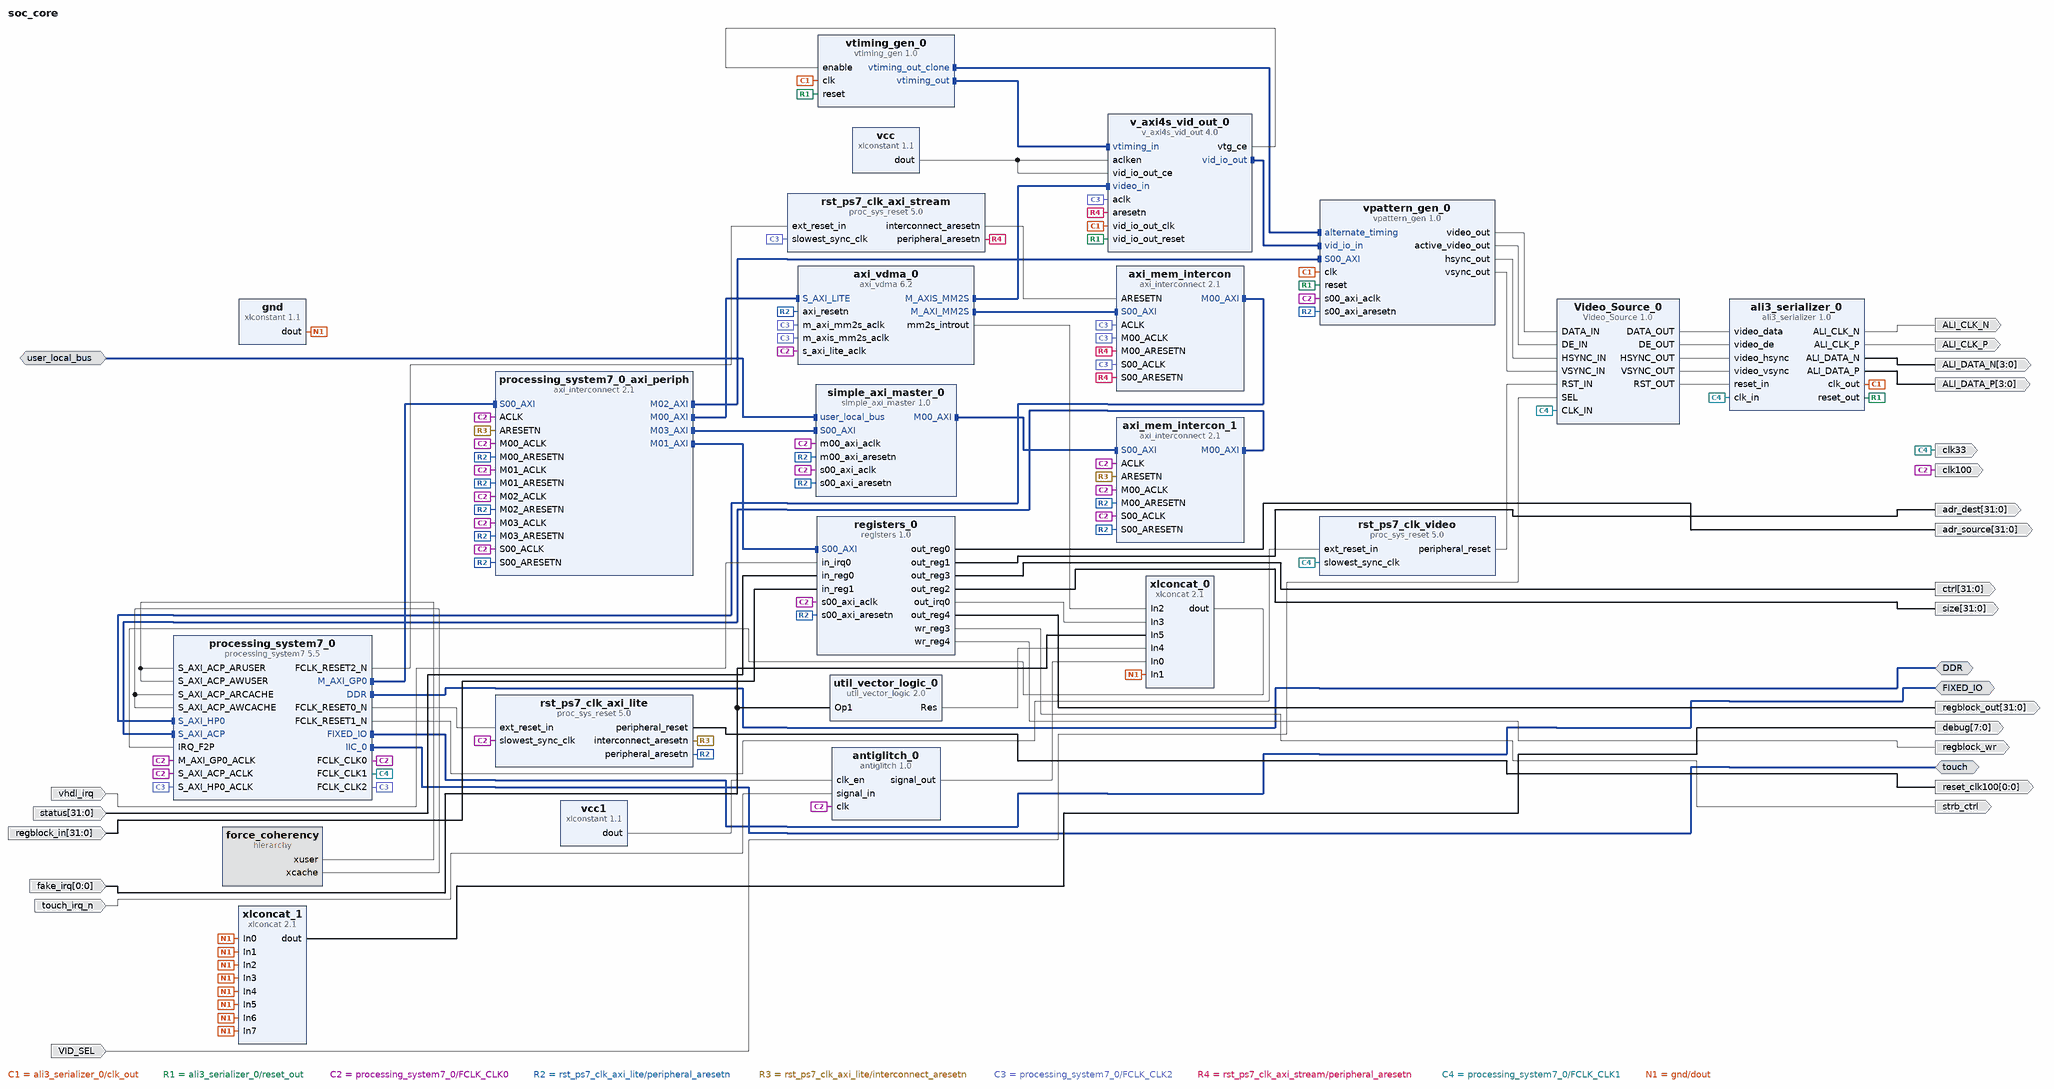
[diagram p0: block diagram of the top level]
# Vivado block design soc_core, Vivado 2015.4
create_bd_design soc_core

create_bd_intf_port -mode Master -vlnv xilinx.com:interface:ddrx_rtl:1.0 DDR
create_bd_intf_port -mode Master -vlnv xilinx.com:display_processing_system7:fixedio_rtl:1.0 FIXED_IO
create_bd_intf_port -mode Slave -vlnv ALE:user:local_bus_rtl:1.0 user_local_bus
create_bd_intf_port -mode Master -vlnv xilinx.com:interface:iic_rtl:1.0 touch
create_bd_port -dir O clk100
create_bd_port -dir O clk33
create_bd_port -dir I touch_irq_n
create_bd_port -dir O ALI_CLK_N
create_bd_port -dir O ALI_CLK_P
create_bd_port -dir O -from 3 -to 0 ALI_DATA_N
create_bd_port -dir O -from 3 -to 0 ALI_DATA_P
create_bd_port -dir O -from 7 -to 0 debug
create_bd_port -dir I vhdl_irq
create_bd_port -dir O -from 31 -to 0 adr_source
create_bd_port -dir O -from 31 -to 0 adr_dest
create_bd_port -dir O -from 31 -to 0 size
create_bd_port -dir O -from 31 -to 0 ctrl
create_bd_port -dir I -from 31 -to 0 status
create_bd_port -dir O -from 0 -to 0 -type rst reset_clk100
create_bd_port -dir O strb_ctrl
create_bd_port -dir I -from 0 -to 0 fake_irq
create_bd_port -dir O -from 31 -to 0 regblock_out
create_bd_port -dir O regblock_wr
create_bd_port -dir I -from 31 -to 0 regblock_in
create_bd_port -dir I VID_SEL

create_bd_cell -type ip -vlnv xilinx.com:ip:v_axi4s_vid_out:4.0 v_axi4s_vid_out_0
set_property -dict [list \
  CONFIG.C_S_AXIS_VIDEO_FORMAT 6 \
  CONFIG.C_HAS_ASYNC_CLK 1 \
  CONFIG.C_VTG_MASTER_SLAVE 1 \
] [get_bd_cells v_axi4s_vid_out_0]
create_bd_cell -type ip -vlnv adetel.com:user:ali3_serializer:1.0 ali3_serializer_0
create_bd_cell -type ip -vlnv xilinx.com:ip:xlconcat:2.1 xlconcat_0
set_property -dict {CONFIG.NUM_PORTS 6} [get_bd_cells xlconcat_0]
create_bd_cell -type ip -vlnv xilinx.com:ip:axi_vdma:6.2 axi_vdma_0
set_property -dict [list \
  CONFIG.c_num_fstores 1 \
  CONFIG.c_mm2s_genlock_mode 0 \
  CONFIG.c_mm2s_linebuffer_depth 4096 \
  CONFIG.c_mm2s_max_burst_length 16 \
  CONFIG.c_include_s2mm 0 \
  CONFIG.c_include_mm2s_dre 1 \
] [get_bd_cells axi_vdma_0]
create_bd_cell -type ip -vlnv xilinx.com:ip:axi_interconnect:2.1 processing_system7_0_axi_periph
set_property -dict {CONFIG.NUM_MI 4} [get_bd_cells processing_system7_0_axi_periph]
create_bd_cell -type ip -vlnv xilinx.com:ip:axi_interconnect:2.1 axi_mem_intercon
set_property -dict {CONFIG.NUM_MI 1} [get_bd_cells axi_mem_intercon]
create_bd_cell -type ip -vlnv xilinx.com:ip:xlconstant:1.1 vcc
create_bd_cell -type ip -vlnv adetel.com:user:antiglitch:1.0 antiglitch_0
set_property -dict {CONFIG.FILTER_SIZE 4 CONFIG.INIT_VAL {"1"} CONFIG.INVERT_OUT {"1"}} [get_bd_cells antiglitch_0]
create_bd_cell -type ip -vlnv xilinx.com:ip:xlconstant:1.1 vcc1
create_bd_cell -type ip -vlnv xilinx.com:ip:xlconcat:2.1 xlconcat_1
set_property -dict {CONFIG.NUM_PORTS 8} [get_bd_cells xlconcat_1]
create_bd_cell -type ip -vlnv adetel.com:user:vtiming_gen:1.0 vtiming_gen_0
create_bd_cell -type ip -vlnv xilinx.com:ip:xlconstant:1.1 gnd
set_property -dict {CONFIG.CONST_VAL 0} [get_bd_cells gnd]
create_bd_cell -type ip -vlnv adetel.com:user:vpattern_gen:1.0 vpattern_gen_0
create_bd_cell -type ip -vlnv ALE:user:simple_axi_master:1.0 simple_axi_master_0
create_bd_cell -type ip -vlnv xilinx.com:ip:axi_interconnect:2.1 axi_mem_intercon_1
set_property -dict {CONFIG.NUM_MI 1} [get_bd_cells axi_mem_intercon_1]
create_bd_cell -type hier force_coherency
create_bd_cell -type ip -vlnv ALE:user:registers:1.0 registers_0
set_property -dict [list \
  CONFIG.RESYNC_INPUTS true \
  CONFIG.NUM_OUTPUTS 5 \
  CONFIG.NUM_INPUTS 2 \
  CONFIG.NUM_IRQ 1 \
] [get_bd_cells registers_0]
create_bd_cell -type ip -vlnv xilinx.com:ip:processing_system7:5.5 processing_system7_0
set_property -dict [list \
  CONFIG.PCW_FCLK_CLK0_BUF true \
  CONFIG.PCW_FCLK_CLK1_BUF true \
  CONFIG.PCW_FCLK_CLK2_BUF true \
  CONFIG.PCW_APU_PERIPHERAL_FREQMHZ 667 \
  CONFIG.PCW_SDIO_PERIPHERAL_FREQMHZ 50 \
  CONFIG.PCW_UART_PERIPHERAL_FREQMHZ 50 \
  CONFIG.PCW_FPGA0_PERIPHERAL_FREQMHZ 100 \
  CONFIG.PCW_FPGA1_PERIPHERAL_FREQMHZ 33.333333 \
  CONFIG.PCW_FPGA2_PERIPHERAL_FREQMHZ 100 \
  CONFIG.PCW_USE_S_AXI_ACP 1 \
  CONFIG.PCW_USE_S_AXI_HP0 1 \
  CONFIG.PCW_USE_FABRIC_INTERRUPT 1 \
  CONFIG.PCW_USE_DEFAULT_ACP_USER_VAL 1 \
  CONFIG.PCW_EN_CLK1_PORT 1 \
  CONFIG.PCW_EN_CLK2_PORT 1 \
  CONFIG.PCW_EN_RST1_PORT 1 \
  CONFIG.PCW_EN_RST2_PORT 1 \
  CONFIG.PCW_IRQ_F2P_INTR 1 \
  CONFIG.PCW_PRESET_BANK1_VOLTAGE {LVCMOS 1.8V} \
  CONFIG.PCW_UIPARAM_DDR_MEMORY_TYPE {DDR 3 (Low Voltage)} \
  CONFIG.PCW_UIPARAM_DDR_PARTNO {MT41K256M16 RE-125} \
  CONFIG.PCW_QSPI_PERIPHERAL_ENABLE 1 \
  CONFIG.PCW_QSPI_GRP_SINGLE_SS_ENABLE 1 \
  CONFIG.PCW_QSPI_GRP_SINGLE_SS_IO {MIO 1 .. 6} \
  CONFIG.PCW_QSPI_GRP_FBCLK_ENABLE 1 \
  CONFIG.PCW_QSPI_GRP_FBCLK_IO {MIO 8} \
  CONFIG.PCW_ENET0_PERIPHERAL_ENABLE 1 \
  CONFIG.PCW_ENET0_ENET0_IO {MIO 16 .. 27} \
  CONFIG.PCW_ENET0_GRP_MDIO_ENABLE 1 \
  CONFIG.PCW_ENET0_GRP_MDIO_IO {MIO 52 .. 53} \
  CONFIG.PCW_ENET0_RESET_ENABLE 0 \
  CONFIG.PCW_SD0_PERIPHERAL_ENABLE 1 \
  CONFIG.PCW_SD0_SD0_IO {MIO 40 .. 45} \
  CONFIG.PCW_SD0_GRP_CD_ENABLE 1 \
  CONFIG.PCW_SD0_GRP_CD_IO {MIO 46} \
  CONFIG.PCW_SD0_GRP_WP_ENABLE 1 \
  CONFIG.PCW_SD0_GRP_WP_IO {MIO 50} \
  CONFIG.PCW_UART1_PERIPHERAL_ENABLE 1 \
  CONFIG.PCW_UART1_UART1_IO {MIO 48 .. 49} \
  CONFIG.PCW_TTC0_PERIPHERAL_ENABLE 1 \
  CONFIG.PCW_TTC0_TTC0_IO EMIO \
  CONFIG.PCW_USB0_PERIPHERAL_ENABLE 1 \
  CONFIG.PCW_USB0_USB0_IO {MIO 28 .. 39} \
  CONFIG.PCW_USB0_RESET_ENABLE 1 \
  CONFIG.PCW_USB0_RESET_IO {MIO 7} \
  CONFIG.PCW_I2C0_PERIPHERAL_ENABLE 1 \
  CONFIG.PCW_I2C_RESET_ENABLE 0 \
  CONFIG.PCW_GPIO_PERIPHERAL_ENABLE 1 \
  CONFIG.PCW_GPIO_MIO_GPIO_ENABLE 1 \
] [get_bd_cells processing_system7_0]
# 156 more settings of processing_system7_0 are not shown: defaults, MIO pin electricals, DDR timing, and values the tool derives
create_bd_cell -type ip -vlnv xilinx.com:ip:proc_sys_reset:5.0 rst_ps7_clk_axi_lite
create_bd_cell -type ip -vlnv xilinx.com:ip:proc_sys_reset:5.0 rst_ps7_clk_axi_stream
create_bd_cell -type ip -vlnv xilinx.com:ip:proc_sys_reset:5.0 rst_ps7_clk_video
create_bd_cell -type ip -vlnv xilinx.com:ip:util_vector_logic:2.0 util_vector_logic_0
set_property -dict {CONFIG.C_SIZE 1 CONFIG.C_OPERATION not} [get_bd_cells util_vector_logic_0]
create_bd_cell -type ip -vlnv xilinx.com:user:Video_Source:1.0 Video_Source_0

# ---- hierarchy /force_coherency ----
current_bd_instance /force_coherency
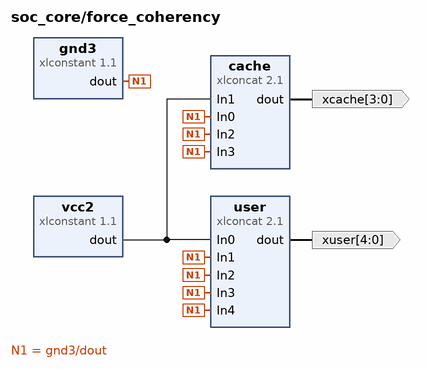
[diagram p1: block diagram inside /force_coherency]
create_bd_pin -dir O -from 4 -to 0 xuser
create_bd_pin -dir O -from 3 -to 0 xcache

create_bd_cell -type ip -vlnv xilinx.com:ip:xlconcat:2.1 user
set_property -dict {CONFIG.NUM_PORTS 5} [get_bd_cells user]
create_bd_cell -type ip -vlnv xilinx.com:ip:xlconstant:1.1 vcc2
create_bd_cell -type ip -vlnv xilinx.com:ip:xlconstant:1.1 gnd3
set_property -dict {CONFIG.CONST_VAL 0} [get_bd_cells gnd3]
create_bd_cell -type ip -vlnv xilinx.com:ip:xlconcat:2.1 cache
set_property -dict {CONFIG.NUM_PORTS 4} [get_bd_cells cache]

# ---- connections ----

current_bd_instance /force_coherency
connect_bd_net [get_bd_pins user/dout] [get_bd_pins xuser]
connect_bd_net -net In2_1 [get_bd_pins gnd3/dout] \
  [get_bd_pins user/In2] [get_bd_pins user/In3] [get_bd_pins user/In4] [get_bd_pins user/In1] [get_bd_pins cache/In2] \
  [get_bd_pins cache/In3] [get_bd_pins cache/In0]
connect_bd_net -net In0_1 [get_bd_pins vcc2/dout] [get_bd_pins user/In0] [get_bd_pins cache/In1]
connect_bd_net [get_bd_pins cache/dout] [get_bd_pins xcache]

current_bd_instance /
connect_bd_intf_net [get_bd_intf_pins v_axi4s_vid_out_0/vid_io_out] [get_bd_intf_pins vpattern_gen_0/vid_io_in]
connect_bd_intf_net [get_bd_intf_pins axi_vdma_0/M_AXIS_MM2S] [get_bd_intf_pins v_axi4s_vid_out_0/video_in]
connect_bd_intf_net [get_bd_intf_pins processing_system7_0/M_AXI_GP0] [get_bd_intf_pins processing_system7_0_axi_periph/S00_AXI]
connect_bd_intf_net [get_bd_intf_pins processing_system7_0_axi_periph/M00_AXI] [get_bd_intf_pins axi_vdma_0/S_AXI_LITE]
connect_bd_intf_net [get_bd_intf_pins axi_vdma_0/M_AXI_MM2S] [get_bd_intf_pins axi_mem_intercon/S00_AXI]
connect_bd_intf_net [get_bd_intf_pins axi_mem_intercon/M00_AXI] [get_bd_intf_pins processing_system7_0/S_AXI_HP0]
connect_bd_intf_net [get_bd_intf_pins processing_system7_0_axi_periph/M02_AXI] [get_bd_intf_pins vpattern_gen_0/S00_AXI]
connect_bd_intf_net [get_bd_intf_pins vtiming_gen_0/vtiming_out] [get_bd_intf_pins v_axi4s_vid_out_0/vtiming_in]
connect_bd_intf_net [get_bd_intf_pins vtiming_gen_0/vtiming_out_clone] [get_bd_intf_pins vpattern_gen_0/alternate_timing]
connect_bd_intf_net [get_bd_intf_pins simple_axi_master_0/M00_AXI] [get_bd_intf_pins axi_mem_intercon_1/S00_AXI]
connect_bd_intf_net [get_bd_intf_pins axi_mem_intercon_1/M00_AXI] [get_bd_intf_pins processing_system7_0/S_AXI_ACP]
connect_bd_intf_net [get_bd_intf_pins processing_system7_0_axi_periph/M03_AXI] [get_bd_intf_pins simple_axi_master_0/S00_AXI]
connect_bd_intf_net [get_bd_intf_pins processing_system7_0_axi_periph/M01_AXI] [get_bd_intf_pins registers_0/S00_AXI]
connect_bd_intf_net [get_bd_intf_ports DDR] [get_bd_intf_pins processing_system7_0/DDR]
connect_bd_intf_net [get_bd_intf_ports FIXED_IO] [get_bd_intf_pins processing_system7_0/FIXED_IO]
connect_bd_intf_net [get_bd_intf_ports user_local_bus] [get_bd_intf_pins simple_axi_master_0/user_local_bus]
connect_bd_intf_net [get_bd_intf_ports touch] [get_bd_intf_pins processing_system7_0/IIC_0]
connect_bd_net [get_bd_pins ali3_serializer_0/clk_out] \
  [get_bd_pins v_axi4s_vid_out_0/vid_io_out_clk] [get_bd_pins vtiming_gen_0/clk] [get_bd_pins vpattern_gen_0/clk]
connect_bd_net [get_bd_pins ali3_serializer_0/reset_out] \
  [get_bd_pins v_axi4s_vid_out_0/vid_io_out_reset] [get_bd_pins vtiming_gen_0/reset] [get_bd_pins vpattern_gen_0/reset]
connect_bd_net [get_bd_pins v_axi4s_vid_out_0/vtg_ce] [get_bd_pins vtiming_gen_0/enable]
connect_bd_net [get_bd_pins xlconcat_0/dout] [get_bd_pins processing_system7_0/IRQ_F2P]
connect_bd_net [get_bd_pins axi_vdma_0/mm2s_introut] [get_bd_pins xlconcat_0/In2]
connect_bd_net [get_bd_pins processing_system7_0/FCLK_CLK0] \
  [get_bd_ports clk100] [get_bd_pins axi_vdma_0/s_axi_lite_aclk] [get_bd_pins antiglitch_0/clk] \
  [get_bd_pins vpattern_gen_0/s00_axi_aclk] [get_bd_pins simple_axi_master_0/m00_axi_aclk] \
  [get_bd_pins simple_axi_master_0/s00_axi_aclk] [get_bd_pins registers_0/s00_axi_aclk] \
  [get_bd_pins processing_system7_0/M_AXI_GP0_ACLK] [get_bd_pins processing_system7_0/S_AXI_ACP_ACLK] \
  [get_bd_pins rst_ps7_clk_axi_lite/slowest_sync_clk] [get_bd_pins processing_system7_0_axi_periph/S00_ACLK] \
  [get_bd_pins processing_system7_0_axi_periph/ACLK] [get_bd_pins processing_system7_0_axi_periph/M00_ACLK] \
  [get_bd_pins processing_system7_0_axi_periph/M01_ACLK] [get_bd_pins processing_system7_0_axi_periph/M02_ACLK] \
  [get_bd_pins axi_mem_intercon_1/S00_ACLK] [get_bd_pins axi_mem_intercon_1/ACLK] [get_bd_pins axi_mem_intercon_1/M00_ACLK] \
  [get_bd_pins processing_system7_0_axi_periph/M03_ACLK]
connect_bd_net [get_bd_pins processing_system7_0/FCLK_RESET0_N] [get_bd_pins rst_ps7_clk_axi_lite/ext_reset_in]
connect_bd_net -net rst_processing_system7_0_100M_peripheral_aresetn [get_bd_pins rst_ps7_clk_axi_lite/peripheral_aresetn] \
  [get_bd_pins axi_vdma_0/axi_resetn] [get_bd_pins vpattern_gen_0/s00_axi_aresetn] \
  [get_bd_pins simple_axi_master_0/m00_axi_aresetn] [get_bd_pins simple_axi_master_0/s00_axi_aresetn] \
  [get_bd_pins registers_0/s00_axi_aresetn] [get_bd_pins processing_system7_0_axi_periph/S00_ARESETN] \
  [get_bd_pins processing_system7_0_axi_periph/M00_ARESETN] [get_bd_pins processing_system7_0_axi_periph/M01_ARESETN] \
  [get_bd_pins processing_system7_0_axi_periph/M02_ARESETN] [get_bd_pins axi_mem_intercon_1/S00_ARESETN] \
  [get_bd_pins axi_mem_intercon_1/M00_ARESETN] [get_bd_pins processing_system7_0_axi_periph/M03_ARESETN]
connect_bd_net -net rst_processing_system7_0_100M_interconnect_aresetn [get_bd_pins rst_ps7_clk_axi_lite/interconnect_aresetn] \
  [get_bd_pins processing_system7_0_axi_periph/ARESETN] [get_bd_pins axi_mem_intercon_1/ARESETN]
connect_bd_net [get_bd_pins processing_system7_0/FCLK_CLK2] \
  [get_bd_pins axi_vdma_0/m_axi_mm2s_aclk] [get_bd_pins v_axi4s_vid_out_0/aclk] [get_bd_pins axi_vdma_0/m_axis_mm2s_aclk] \
  [get_bd_pins processing_system7_0/S_AXI_HP0_ACLK] [get_bd_pins rst_ps7_clk_axi_stream/slowest_sync_clk] \
  [get_bd_pins axi_mem_intercon/S00_ACLK] [get_bd_pins axi_mem_intercon/ACLK] [get_bd_pins axi_mem_intercon/M00_ACLK]
connect_bd_net [get_bd_pins processing_system7_0/FCLK_RESET2_N] [get_bd_pins rst_ps7_clk_axi_stream/ext_reset_in]
connect_bd_net -net rst_processing_system7_0_100M_peripheral_aresetn1 [get_bd_pins rst_ps7_clk_axi_stream/peripheral_aresetn] \
  [get_bd_pins v_axi4s_vid_out_0/aresetn] [get_bd_pins axi_mem_intercon/S00_ARESETN] \
  [get_bd_pins axi_mem_intercon/M00_ARESETN]
connect_bd_net -net rst_processing_system7_0_100M_interconnect_aresetn1 [get_bd_pins rst_ps7_clk_axi_stream/interconnect_aresetn] \
  [get_bd_pins axi_mem_intercon/ARESETN]
connect_bd_net [get_bd_pins processing_system7_0/FCLK_CLK1] \
  [get_bd_ports clk33] [get_bd_pins ali3_serializer_0/clk_in] [get_bd_pins rst_ps7_clk_video/slowest_sync_clk] \
  [get_bd_pins Video_Source_0/CLK_IN]
connect_bd_net [get_bd_pins processing_system7_0/FCLK_RESET1_N] [get_bd_pins rst_ps7_clk_video/ext_reset_in]
connect_bd_net [get_bd_pins vcc/dout] [get_bd_pins v_axi4s_vid_out_0/aclken] [get_bd_pins v_axi4s_vid_out_0/vid_io_out_ce]
connect_bd_net [get_bd_pins antiglitch_0/signal_out] [get_bd_pins xlconcat_0/In0]
connect_bd_net [get_bd_ports touch_irq_n] [get_bd_pins antiglitch_0/signal_in]
connect_bd_net [get_bd_pins vcc1/dout] [get_bd_pins antiglitch_0/clk_en]
connect_bd_net [get_bd_pins ali3_serializer_0/ALI_CLK_N] [get_bd_ports ALI_CLK_N]
connect_bd_net [get_bd_pins ali3_serializer_0/ALI_CLK_P] [get_bd_ports ALI_CLK_P]
connect_bd_net [get_bd_pins ali3_serializer_0/ALI_DATA_N] [get_bd_ports ALI_DATA_N]
connect_bd_net [get_bd_pins ali3_serializer_0/ALI_DATA_P] [get_bd_ports ALI_DATA_P]
connect_bd_net [get_bd_pins xlconcat_1/dout] [get_bd_ports debug]
connect_bd_net [get_bd_pins gnd/dout] \
  [get_bd_pins xlconcat_1/In7] [get_bd_pins xlconcat_1/In0] [get_bd_pins xlconcat_1/In5] [get_bd_pins xlconcat_1/In6] \
  [get_bd_pins xlconcat_1/In4] [get_bd_pins xlconcat_1/In3] [get_bd_pins xlconcat_1/In2] [get_bd_pins xlconcat_1/In1] \
  [get_bd_pins xlconcat_0/In1]
connect_bd_net [get_bd_pins registers_0/out_irq0] [get_bd_pins xlconcat_0/In3]
connect_bd_net -net in_irq0_1 [get_bd_ports vhdl_irq] [get_bd_pins registers_0/in_irq0]
connect_bd_net [get_bd_pins registers_0/out_reg0] [get_bd_ports adr_source]
connect_bd_net [get_bd_pins registers_0/out_reg1] [get_bd_ports adr_dest]
connect_bd_net [get_bd_pins registers_0/out_reg2] [get_bd_ports size]
connect_bd_net [get_bd_pins registers_0/out_reg3] [get_bd_ports ctrl]
connect_bd_net -net in_reg0_1 [get_bd_ports status] [get_bd_pins registers_0/in_reg0]
connect_bd_net [get_bd_pins rst_ps7_clk_axi_lite/peripheral_reset] [get_bd_ports reset_clk100]
connect_bd_net -net user_dout [get_bd_pins force_coherency/xuser] \
  [get_bd_pins processing_system7_0/S_AXI_ACP_ARUSER] [get_bd_pins processing_system7_0/S_AXI_ACP_AWUSER]
connect_bd_net -net cache_dout [get_bd_pins force_coherency/xcache] \
  [get_bd_pins processing_system7_0/S_AXI_ACP_ARCACHE] [get_bd_pins processing_system7_0/S_AXI_ACP_AWCACHE]
connect_bd_net [get_bd_pins registers_0/wr_reg3] [get_bd_ports strb_ctrl]
connect_bd_net [get_bd_pins util_vector_logic_0/Res] [get_bd_pins xlconcat_0/In4]
connect_bd_net -net Op1_1 [get_bd_ports fake_irq] [get_bd_pins util_vector_logic_0/Op1] [get_bd_pins xlconcat_0/In5]
connect_bd_net [get_bd_pins registers_0/out_reg4] [get_bd_ports regblock_out]
connect_bd_net [get_bd_pins registers_0/wr_reg4] [get_bd_ports regblock_wr]
connect_bd_net -net in_reg1_1 [get_bd_ports regblock_in] [get_bd_pins registers_0/in_reg1]
connect_bd_net [get_bd_pins vpattern_gen_0/video_out] [get_bd_pins Video_Source_0/DATA_IN]
connect_bd_net [get_bd_pins vpattern_gen_0/active_video_out] [get_bd_pins Video_Source_0/DE_IN]
connect_bd_net [get_bd_pins vpattern_gen_0/hsync_out] [get_bd_pins Video_Source_0/HSYNC_IN]
connect_bd_net [get_bd_pins vpattern_gen_0/vsync_out] [get_bd_pins Video_Source_0/VSYNC_IN]
connect_bd_net [get_bd_pins Video_Source_0/DATA_OUT] [get_bd_pins ali3_serializer_0/video_data]
connect_bd_net [get_bd_pins Video_Source_0/DE_OUT] [get_bd_pins ali3_serializer_0/video_de]
connect_bd_net [get_bd_pins Video_Source_0/HSYNC_OUT] [get_bd_pins ali3_serializer_0/video_hsync]
connect_bd_net [get_bd_pins Video_Source_0/VSYNC_OUT] [get_bd_pins ali3_serializer_0/video_vsync]
connect_bd_net [get_bd_pins rst_ps7_clk_video/peripheral_reset] [get_bd_pins Video_Source_0/RST_IN]
connect_bd_net [get_bd_pins Video_Source_0/RST_OUT] [get_bd_pins ali3_serializer_0/reset_in]
connect_bd_net [get_bd_ports VID_SEL] [get_bd_pins Video_Source_0/SEL]

# ---- address map ----
assign_bd_address -offset 0x00000000 -range 512M -target_address_space [get_bd_addr_spaces axi_vdma_0/Data_MM2S] [get_bd_addr_segs processing_system7_0/S_AXI_HP0/HP0_DDR_LOWOCM]
assign_bd_address -offset 0x43000000 -range 64K -target_address_space [get_bd_addr_spaces processing_system7_0/Data] [get_bd_addr_segs axi_vdma_0/S_AXI_LITE/Reg]
assign_bd_address -offset 0x43C00000 -range 64K -target_address_space [get_bd_addr_spaces processing_system7_0/Data] [get_bd_addr_segs registers_0/S00_AXI/S00_AXI_reg]
assign_bd_address -offset 0x43C10000 -range 64K -target_address_space [get_bd_addr_spaces processing_system7_0/Data] [get_bd_addr_segs simple_axi_master_0/S00_AXI/S00_AXI_reg]
assign_bd_address -offset 0x43C20000 -range 64K -target_address_space [get_bd_addr_spaces processing_system7_0/Data] [get_bd_addr_segs vpattern_gen_0/S00_AXI/S00_AXI_reg]
assign_bd_address -offset 0x00000000 -range 512M -target_address_space [get_bd_addr_spaces simple_axi_master_0/M00_AXI] [get_bd_addr_segs processing_system7_0/S_AXI_ACP/ACP_DDR_LOWOCM]
assign_bd_address -offset 0x40000000 -range 1G -target_address_space [get_bd_addr_spaces simple_axi_master_0/M00_AXI] [get_bd_addr_segs processing_system7_0/S_AXI_ACP/ACP_M_AXI_GP0]
assign_bd_address -offset 0xE0000000 -range 4M -target_address_space [get_bd_addr_spaces simple_axi_master_0/M00_AXI] [get_bd_addr_segs processing_system7_0/S_AXI_ACP/ACP_IOP]
assign_bd_address -offset 0xFC000000 -range 16M -target_address_space [get_bd_addr_spaces simple_axi_master_0/M00_AXI] [get_bd_addr_segs processing_system7_0/S_AXI_ACP/ACP_QSPI_LINEAR]

validate_bd_design
save_bd_design
